# Altium project ARMBAND.PrjPcb
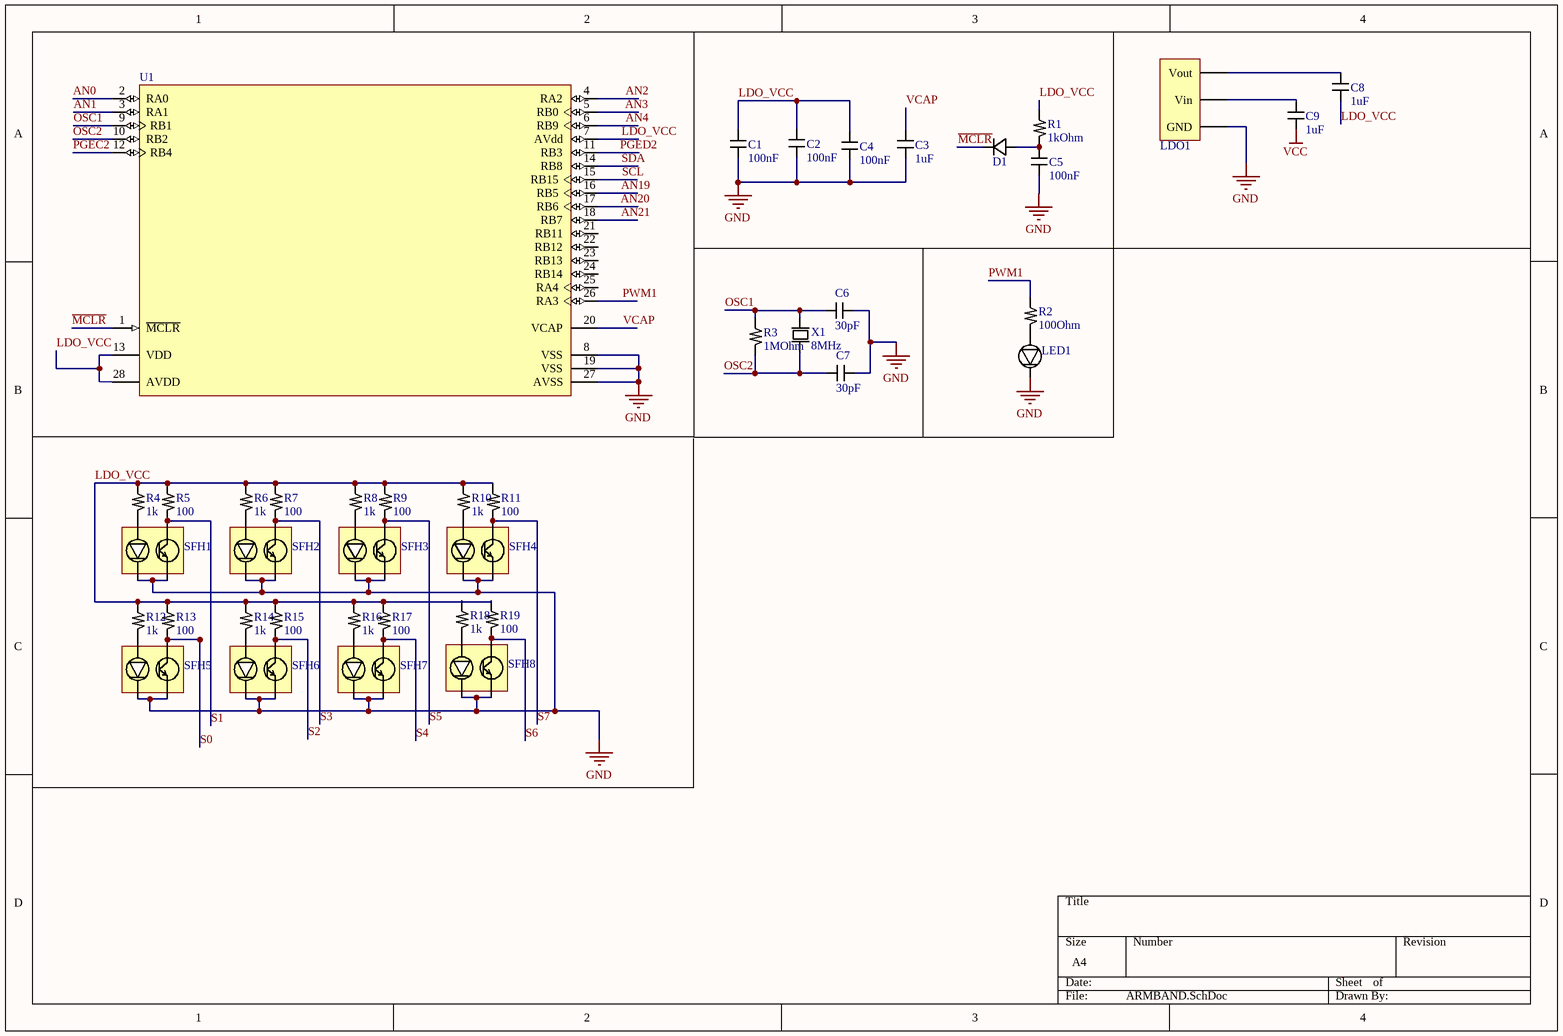
[diagram p0: ARMBAND.SchDoc]
1 sheet, 41 parts. Net scope: global (net labels, ports and power ports of the same name join across sheets).
Board file: armband.PcbDoc

## Sheet ARMBAND.SchDoc
size A4

### Parts
C1  100nF  [CApacitor_1608]
C2  100nF  [CApacitor_1608]
C3  1uF  [Capacitor_20x12]
C4  100nF  [CApacitor_1608]
C5  100nF  [CApacitor_1608]
C6  30pF  [CApacitor_1608]
C7  30pF  [CApacitor_1608]
C8  1uF  [Capacitor_20x12]
C9  1uF  [Capacitor_20x12]
D1  Diode_SMD  [DIODE_17x38]  (value not drawn)
LDO1  Voltage Reg.  [LDO_460x260]  (value not drawn)
LED1  LED_SMD  [LED_1608]  (value not drawn)
R1  1kOhm  [Resistor_1608]
R2  100Ohm  [Resistor_1608]
R3  1MOhm  [Resistor_1608]
R4  1k  [Resistor_1608]
R5  100  [Resistor_1608]
R6  1k  [Resistor_1608]
R7  100  [Resistor_1608]
R8  1k  [Resistor_1608]
R9  100  [Resistor_1608]
R10  1k  [Resistor_1608]
R11  100  [Resistor_1608]
R12  1k  [Resistor_1608]
R13  100  [Resistor_1608]
R14  1k  [Resistor_1608]
R15  100  [Resistor_1608]
R16  1k  [Resistor_1608]
R17  100  [Resistor_1608]
R18  1k  [Resistor_1608]
R19  100  [Resistor_1608]
SFH1  SFH 7250  [SFH_SENSOR_34x30]  (value not drawn)
SFH2  SFH 7250  [SFH_SENSOR_34x30]  (value not drawn)
SFH3  SFH 7250  [SFH_SENSOR_34x30]  (value not drawn)
SFH4  SFH 7250  [SFH_SENSOR_34x30]  (value not drawn)
SFH5  SFH 7250  [SFH_SENSOR_34x30]  (value not drawn)
SFH6  SFH 7250  [SFH_SENSOR_34x30]  (value not drawn)
SFH7  SFH 7250  [SFH_SENSOR_34x30]  (value not drawn)
SFH8  SFH 7250  [SFH_SENSOR_34x30]  (value not drawn)
U1  DSPIC33EP128MC202-I/SO  [MCHP-SOIC-SO28_N]  (value not drawn)
X1  8MHz  [xTal_150x20]

### Nets
GND: C1.Cap_p2 C2.Cap_p2 C3.Cap_p2 C4.Cap_p2 C5.Cap_p2 C6.Cap_p1 C7.Cap_p1 LDO1.GND LED1.Cathode SFH1.LED_Cathode SFH1.PhT_Emitter SFH2.LED_Cathode SFH2.PhT_Emitter SFH3.LED_Cathode SFH3.PhT_Emitter SFH4.LED_Cathode SFH4.PhT_Emitter SFH5.LED_Cathode SFH5.PhT_Emitter SFH6.LED_Cathode SFH6.PhT_Emitter SFH7.LED_Cathode SFH7.PhT_Emitter SFH8.LED_Cathode SFH8.PhT_Emitter U1.8(VSS) U1.19(VSS) U1.27(AVSS)
VCC: C9.Cap_p1
~{MCLR}: D1.Cathode U1.1(~{MCLR})
AN0: U1.2(RA0)
AN1: U1.3(RA1)
AN2: U1.4(RA2)
AN3: U1.5(RB0)
AN4: U1.6(RB9)
AN19: U1.16(RB5)
AN20: U1.17(RB6)
AN21: U1.18(RB7)
LDO_VCC: C1.Cap_p1 C2.Cap_p1 C4.Cap_p1 C8.Cap_p1 R1.Res_p1 R4.Res_p1 R5.Res_p1 R6.Res_p1 R7.Res_p1 R8.Res_p1 R9.Res_p1 R10.Res_p1 R11.Res_p1 R12.Res_p1 R13.Res_p1 R14.Res_p1 R15.Res_p1 R16.Res_p1 R17.Res_p1 R19.Res_p1 U1.7(AVdd) U1.13(VDD) U1.28(AVDD)
OSC1: C6.Cap_p2 R3.Res_p1 U1.9(RB1) X1.xTal_0
OSC2: C7.Cap_p2 R3.Res_p2 U1.10(RB2) X1.xTal_1
PGEC2: U1.12(RB4)
PGED2: U1.11(RB3)
PWM1: R2.Res_p1 U1.26(RA3)
S0: R13.Res_p2 SFH5.PhT_Collector
S1: R5.Res_p2 SFH1.PhT_Collector
S2: R15.Res_p2 SFH6.PhT_Collector
S3: R7.Res_p2 SFH2.PhT_Collector
S4: R17.Res_p2 SFH7.PhT_Collector
S5: R9.Res_p2 SFH3.PhT_Collector
S6: R19.Res_p2 SFH8.PhT_Collector
S7: R11.Res_p2 SFH4.PhT_Collector
SCL: U1.15(RB15)
SDA: U1.14(RB8)
VCAP: C3.Cap_p1 U1.20(VCAP)
NetC5_Cap_p1: C5.Cap_p1 D1.Anode R1.Res_p2
NetC8_Cap_p2: C8.Cap_p2 LDO1.Vout
NetC9_Cap_p2: C9.Cap_p2 LDO1.Vin
NetLED1_Anode: LED1.Anode R2.Res_p2
NetR4_Res_p2: R4.Res_p2 SFH1.LED_Anode
NetR6_Res_p2: R6.Res_p2 SFH2.LED_Anode
NetR8_Res_p2: R8.Res_p2 SFH3.LED_Anode
NetR10_Res_p2: R10.Res_p2 SFH4.LED_Anode
NetR12_Res_p2: R12.Res_p2 SFH5.LED_Anode
NetR14_Res_p2: R14.Res_p2 SFH6.LED_Anode
NetR16_Res_p2: R16.Res_p2 SFH7.LED_Anode
NetR18_Res_p2: R18.Res_p2 SFH8.LED_Anode

Not connected (* = marked no-connect by the designer): R18 Res_p1; U1 21(RB11) 22(RB12) 23(RB13) 24(RB14) 25(RA4)

### Library data of the parts
C1-C9 = Capacitor_SMD: SMD Capacitor
D1 = Diode_SMD: SMD Diode
LDO1 = Voltage_Regulator_3.3V: LDO Voltage Regulator; Manifacturer: ST Microelectronics
LED1 = LED_SMD: SMD Blue LED
R1-R19 = Resistor_SMD: SMD Resistor; Manifacturer: Vishay
SFH1-SFH8 = SFH_7250_Sensor: Infrared Emitter - PhTransistor Receiver; Manifacturer: OSram
U1 = DSPIC33EP128MC202-I/SO: 16-Bit Microcontroller and Digital Signal Controller with High-Speed PWM, Op Amps and Advanced Analog, 70 MIPS, 21 I/O, GPIO, -40 to 85 degC, 28-pin SOIC (SO28), Tube; Manufacturer: Microchip; DatasheetVersion: Rev. F; PackageVersion: C04-052C; PackageReference: SOIC-SO28; PackageDescription: 28-Lead Plastic Small Outline, 17.9 x 7.5 mm Body, 1.27 mm Pitch; Supplier 1: Digi-Key; Supplier Part Number 1: DSPIC33EP128MC202-I/SO-ND; Supplier 2: Mouser; Supplier Part Number 2: 579-33EP128MC202ISO; Mounting Technology: Surface Mount; PartNumber: DSPIC33EP128MC202-I/SO; ComponentLink1Description: Manufacturer URL; ComponentLink1URL: http://www.microchip.com; ComponentLink2Description: Datasheet; ComponentLink2URL: http://ww1.microchip.com/downloads/en/DeviceDoc/70657F.pdf; ComponentLink3Description: Package Specification; ComponentLink3URL: http://www.microchip.com/stellent/groups/techpub_sg/documents/packagingspec/en012702.pdf; ComponentLink4Description: Product URL; ComponentLink4URL: http://www.microchip.com/dsPIC33EP128MC202
X1 = xTal_ECS_inc: 8MHz Crystal/Resonator; Manifacturer: ECS International; Frequency: 8MHz